# Altium schematic sheet FPGA.SchDoc: Pin Swapping
size 863 x 558 mm; DocumentNumber: 4; SheetNumber: 4; SheetTotal: 5
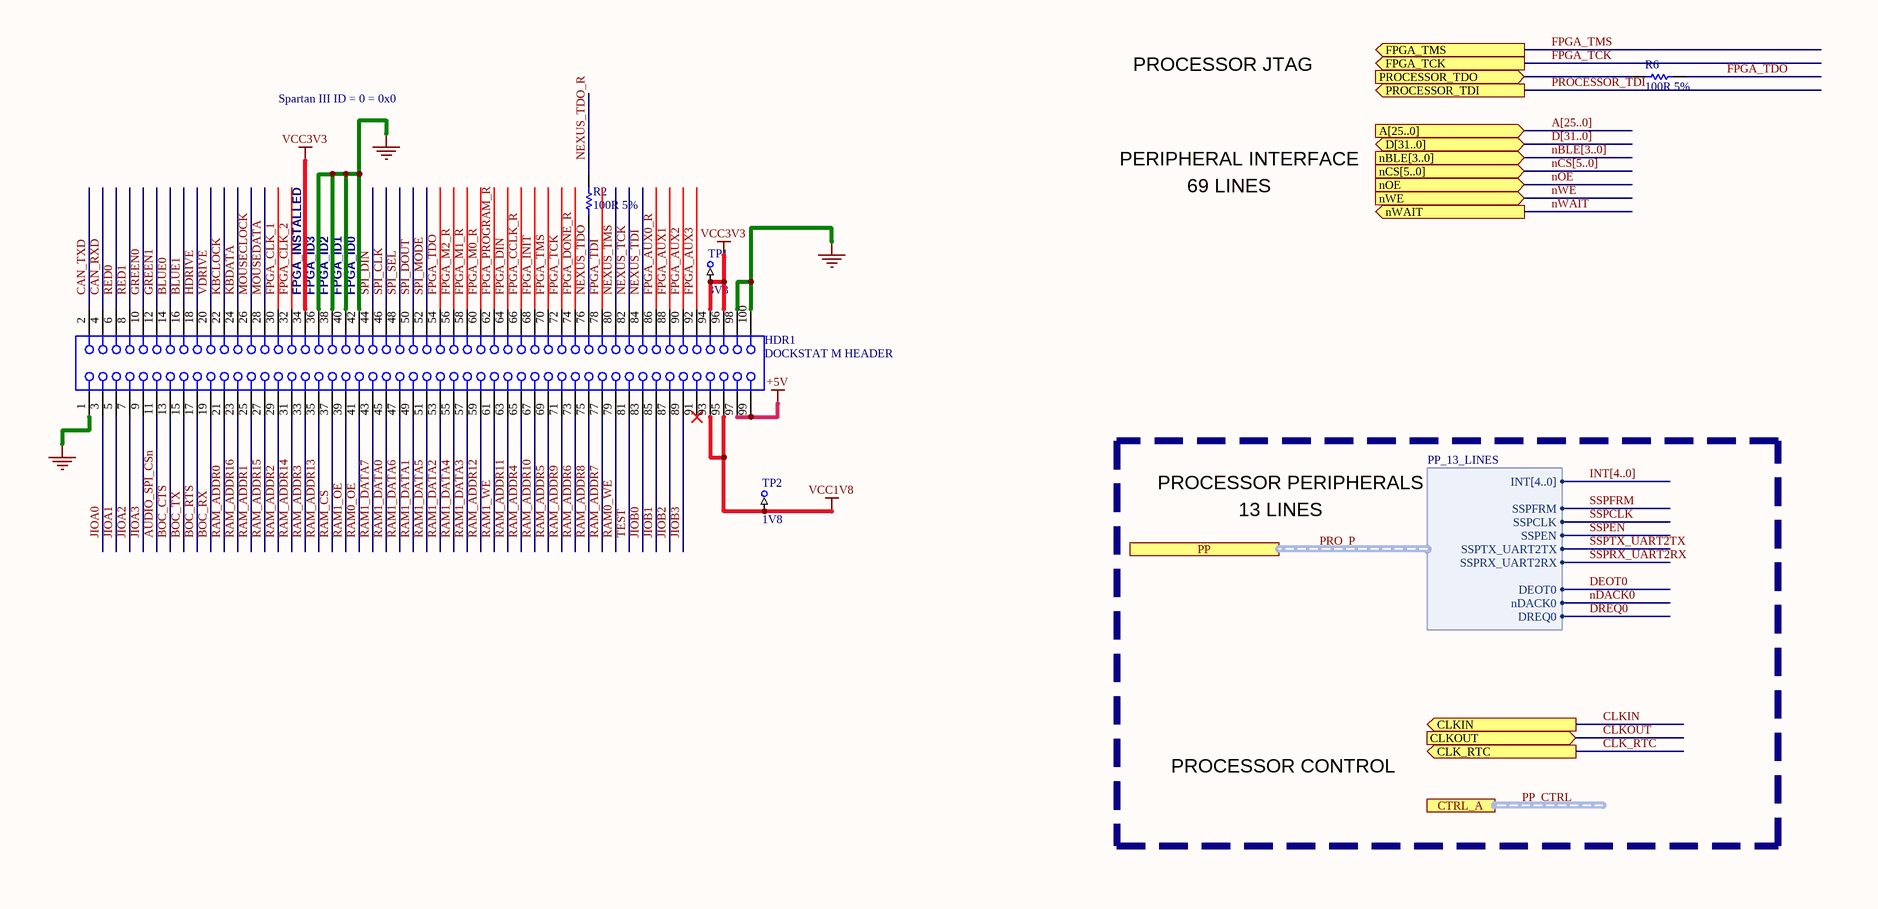
[diagram p0: FPGA.SchDoc, top left]
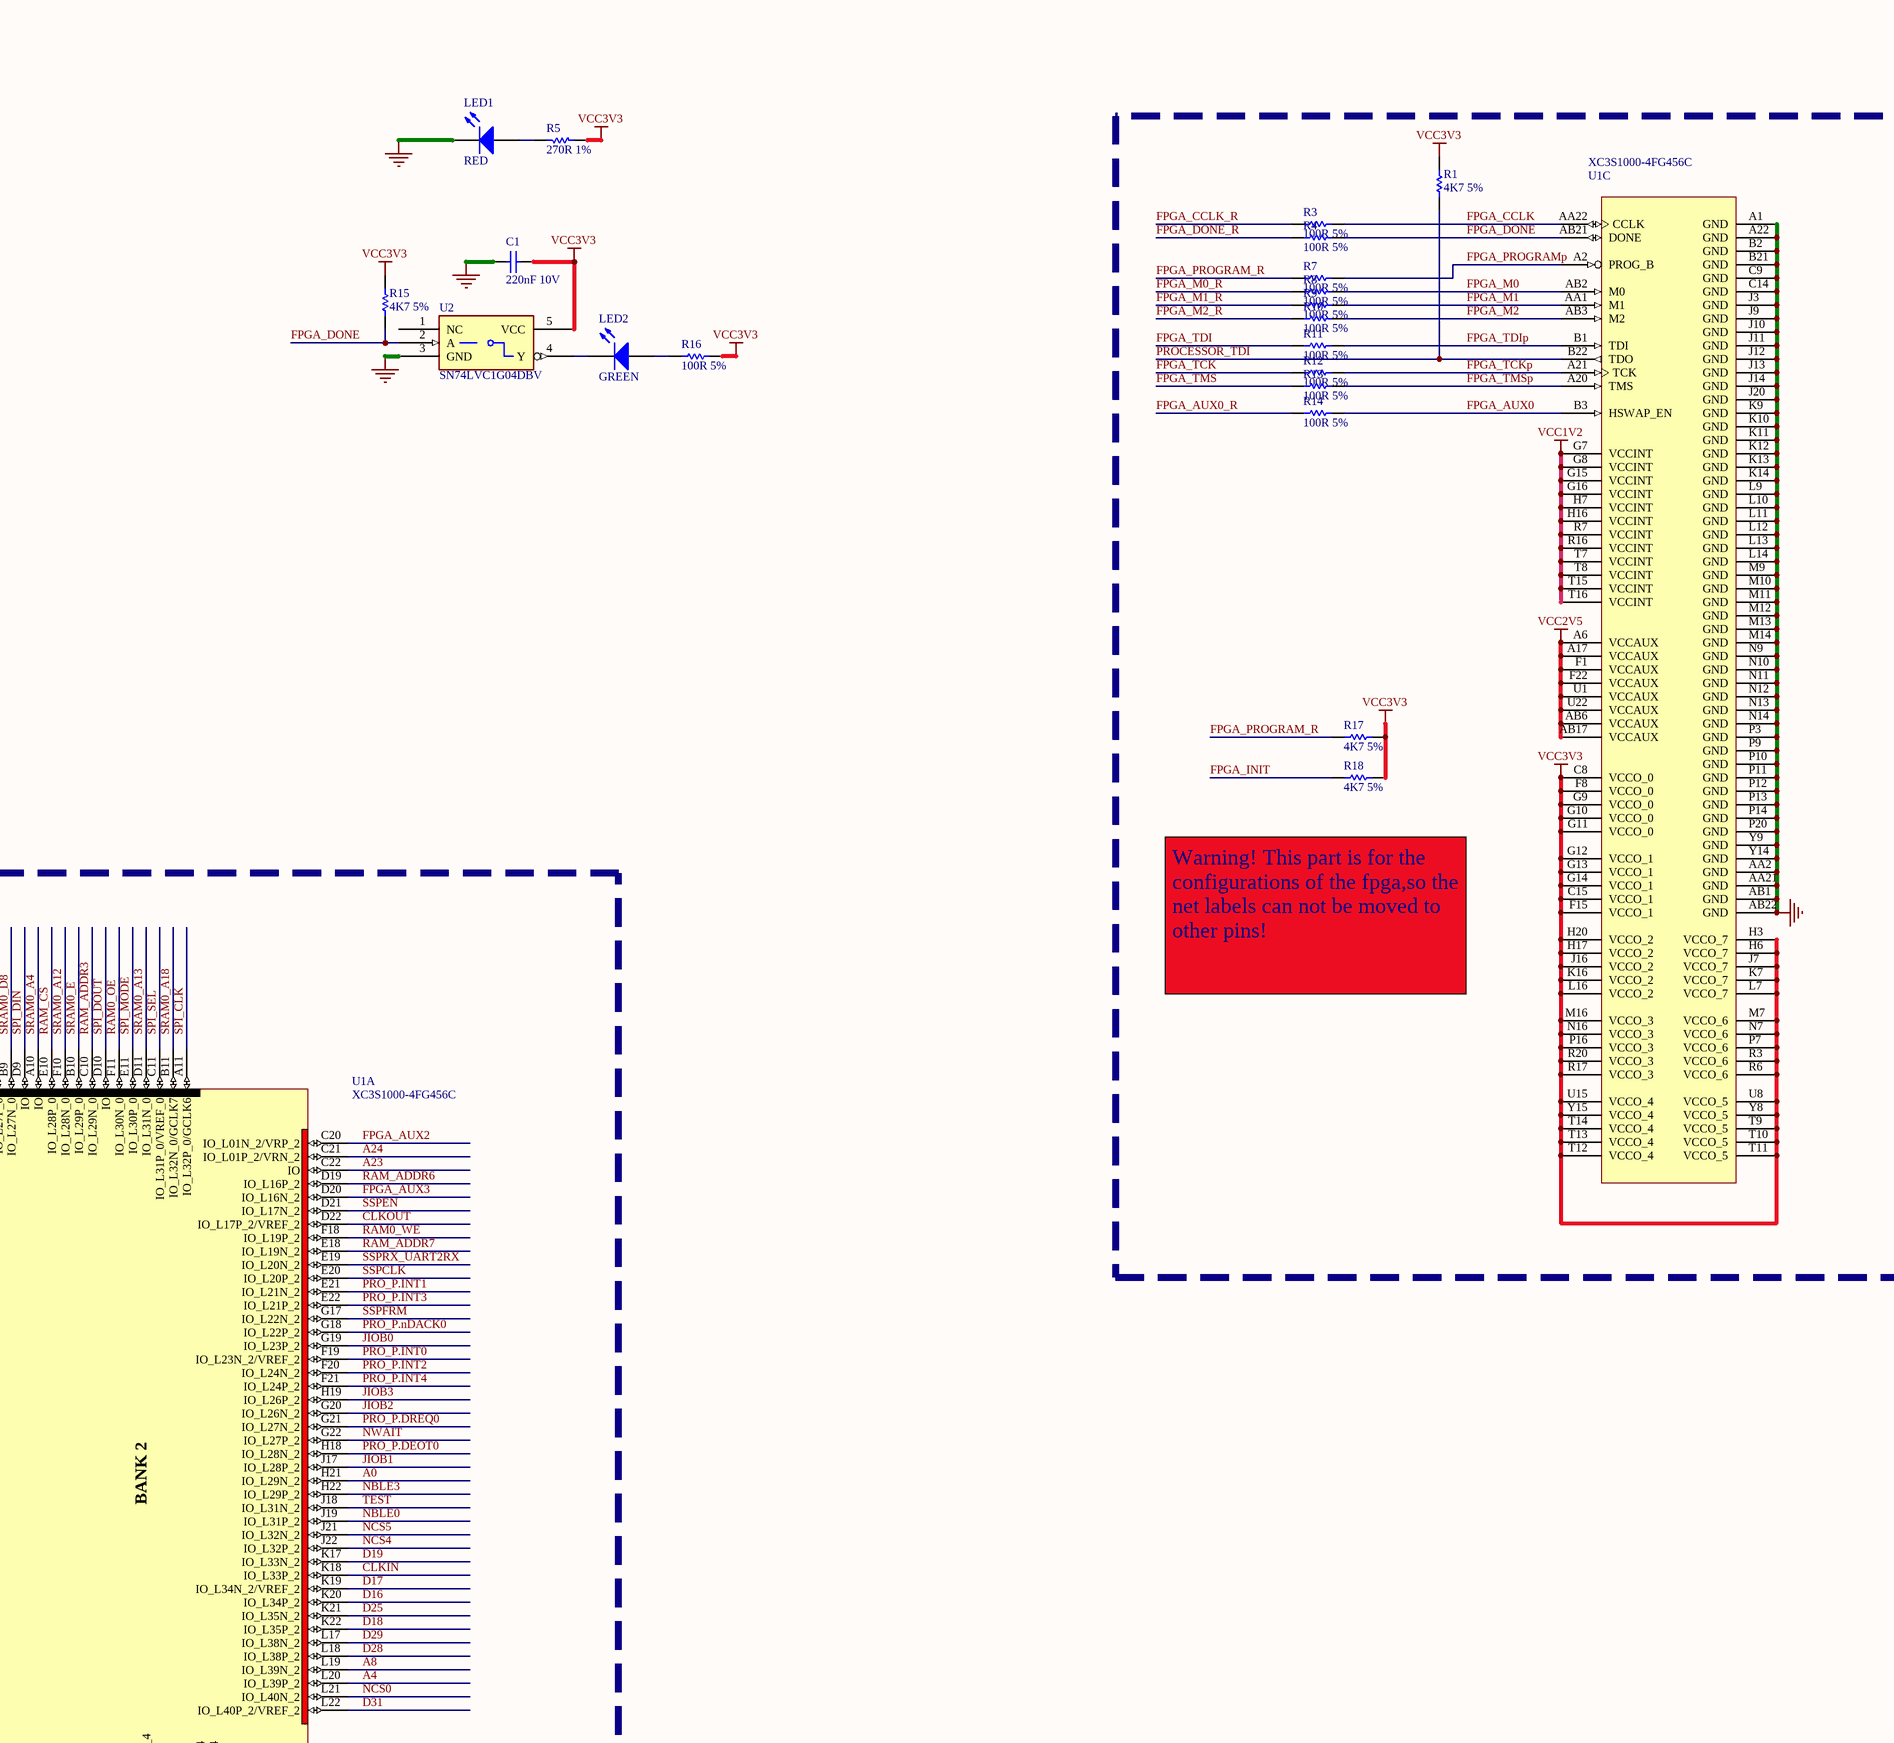
[diagram p1: FPGA.SchDoc, top right]
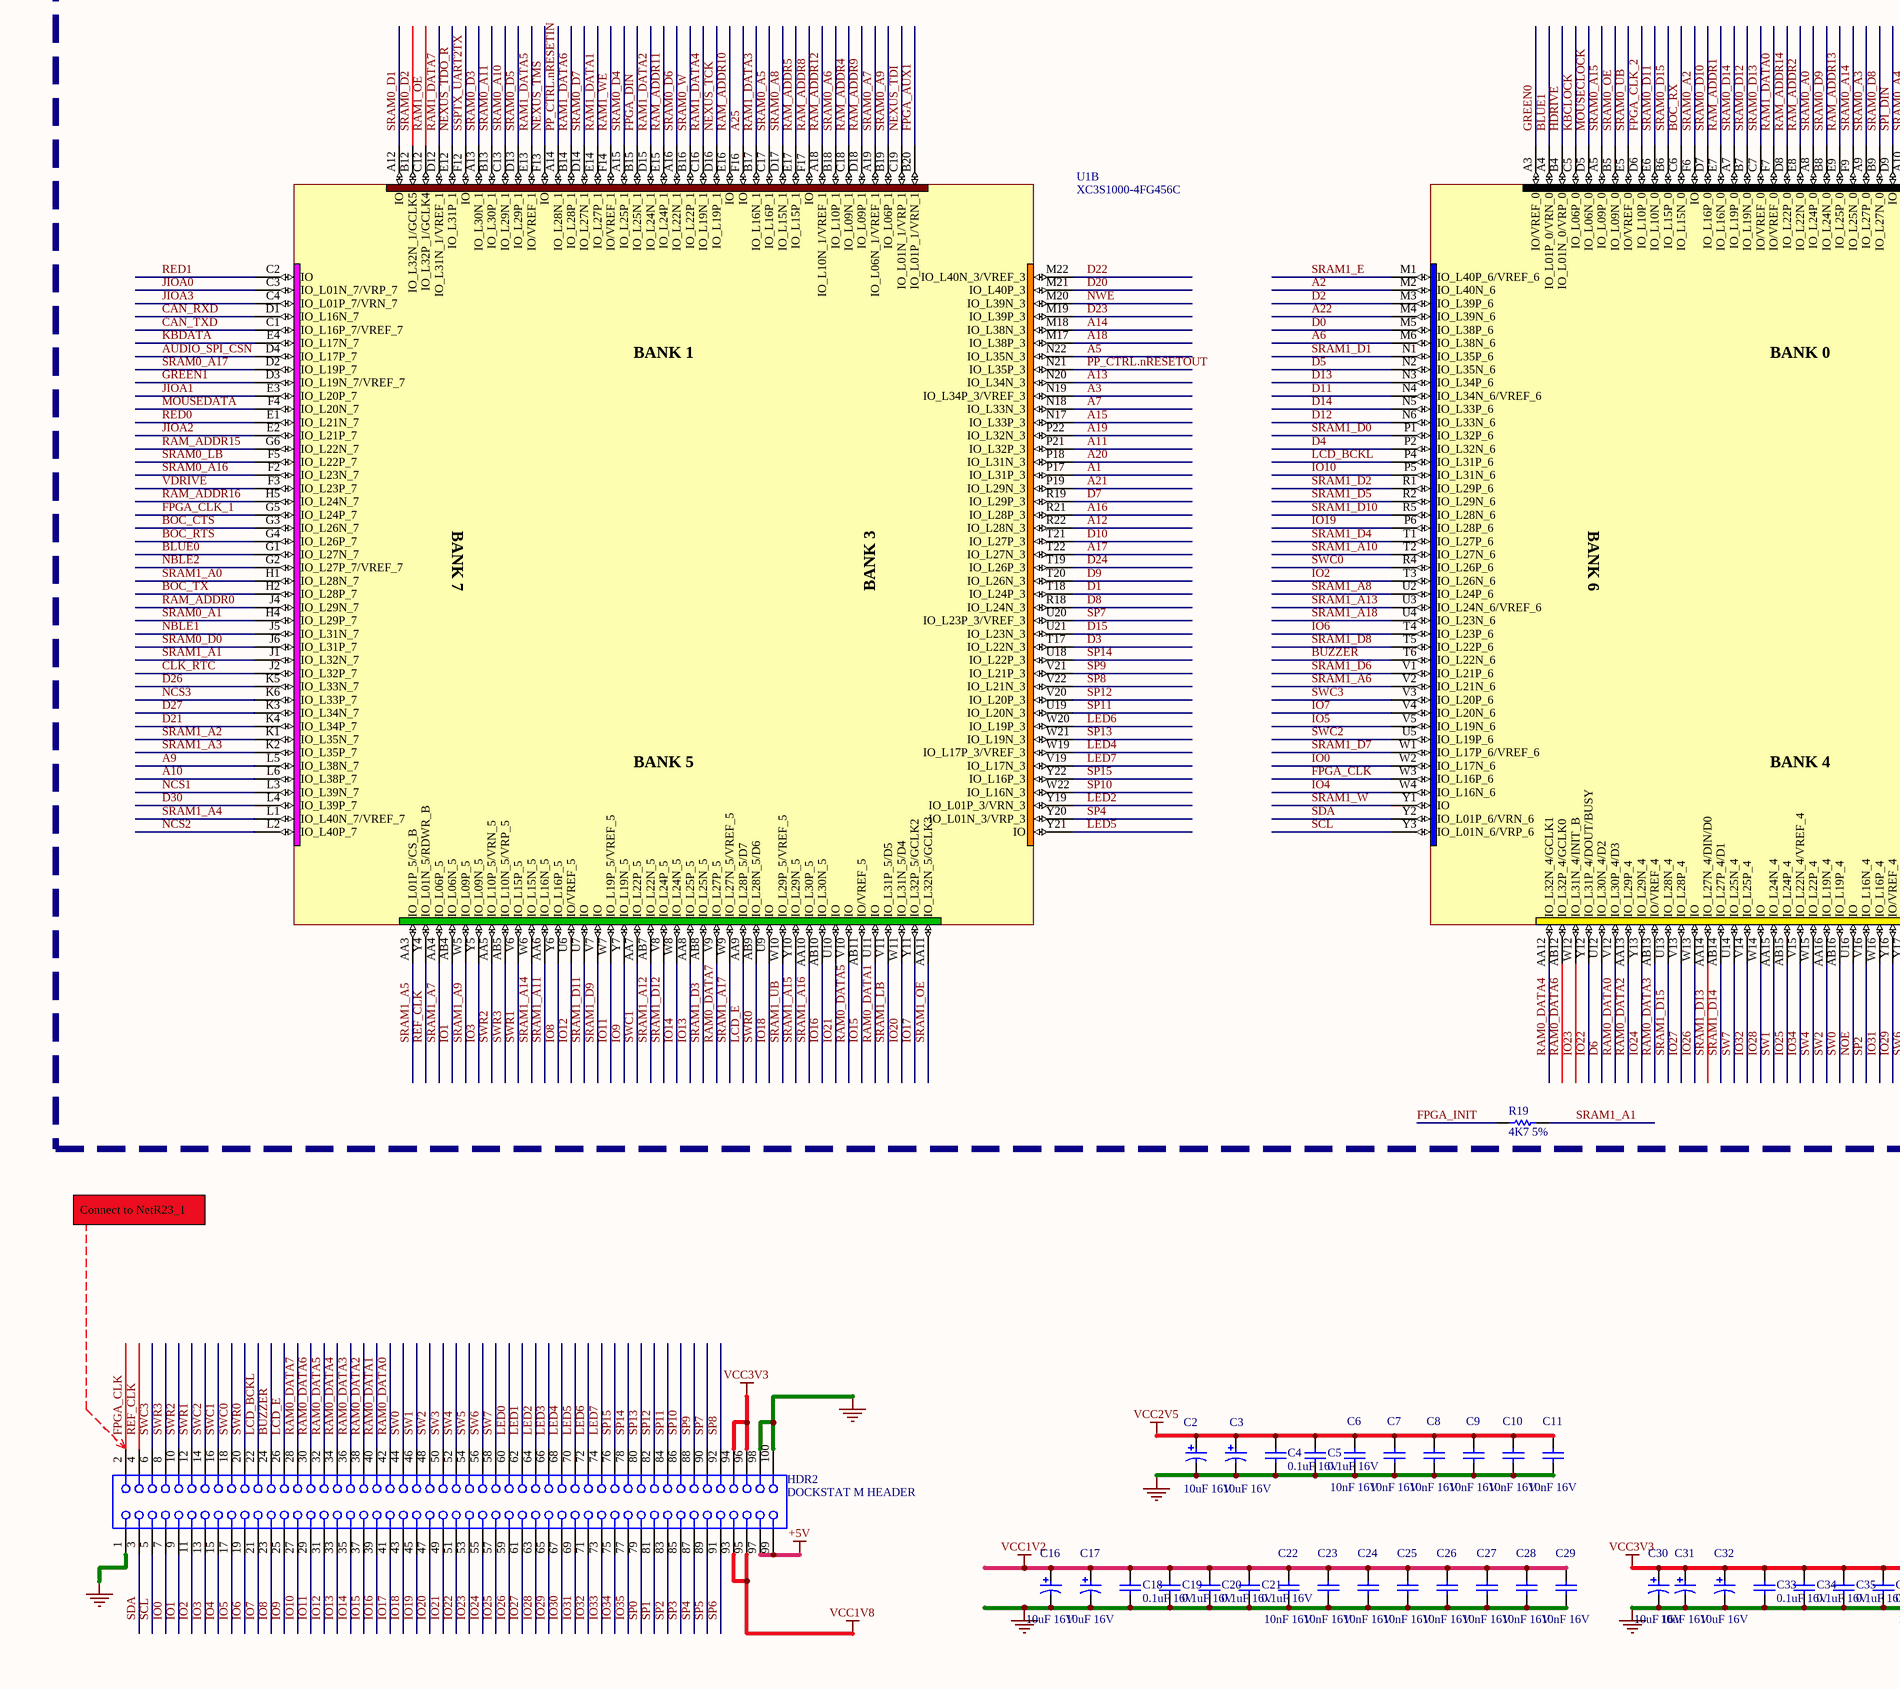
[diagram p2: FPGA.SchDoc, bottom left]
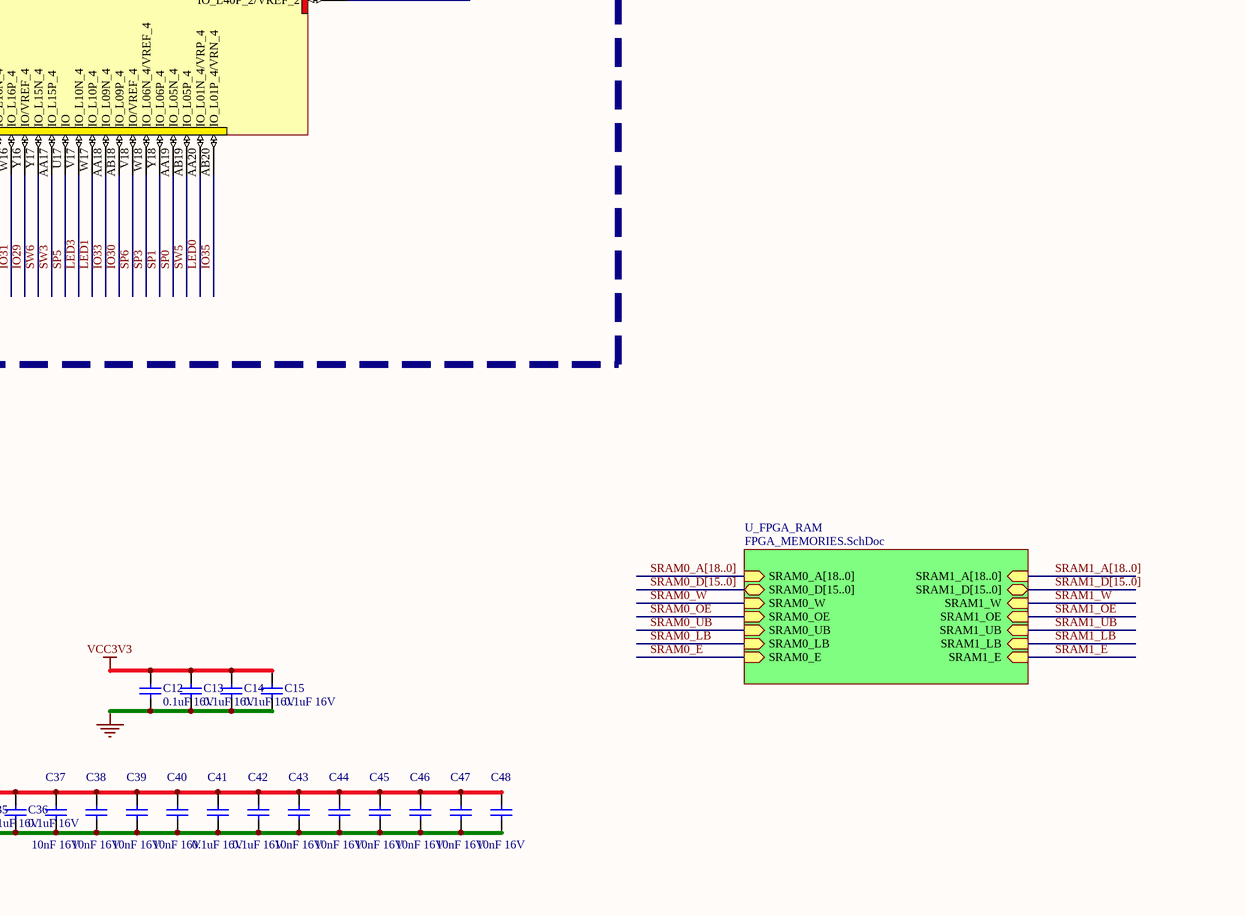
[diagram p3: FPGA.SchDoc, bottom right]

## Parts
C1  220nF 10V  [CAPC1608]
C2  10uF 16V  [CAPC3528]
C3  10uF 16V  [CAPC3528]
C4  0.1uF 16V  [CAPC1005]
C5  0.1uF 16V  [CAPC1005]
C6  10nF 16V  [CAPC1005]
C7  10nF 16V  [CAPC1005]
C8  10nF 16V  [CAPC1005]
C9  10nF 16V  [CAPC1005]
C10  10nF 16V  [CAPC1005]
C11  10nF 16V  [CAPC1005]
C12  0.1uF 16V  [CAPC1005]
C13  0.1uF 16V  [CAPC1005]
C14  0.1uF 16V  [CAPC1005]
C15  0.1uF 16V  [CAPC1005]
C16  10uF 16V  [CAPC3528]
C17  10uF 16V  [CAPC3528]
C18  0.1uF 16V  [CAPC1005]
C19  0.1uF 16V  [CAPC1005]
C20  0.1uF 16V  [CAPC1005]
C21  0.1uF 16V  [CAPC1005]
C22  10nF 16V  [CAPC1005]
C23  10nF 16V  [CAPC1005]
C24  10nF 16V  [CAPC1005]
C25  10nF 16V  [CAPC1005]
C26  10nF 16V  [CAPC1005]
C27  10nF 16V  [CAPC1005]
C28  10nF 16V  [CAPC1005]
C29  10nF 16V  [CAPC1005]
C30  10uF 16V  [CAPC3528]
C31  10uF 16V  [CAPC3528]
C32  10uF 16V  [CAPC3528]
C33  0.1uF 16V  [CAPC1005]
C34  0.1uF 16V  [CAPC1005]
C35  0.1uF 16V  [CAPC1005]
C36  0.1uF 16V  [CAPC1005]
C37  10nF 16V  [CAPC1005]
C38  10nF 16V  [CAPC1005]
C39  10nF 16V  [CAPC1005]
C40  10nF 16V  [CAPC1005]
C41  0.1uF 16V  [CAPC1005]
C42  0.1uF 16V  [CAPC1005]
C43  10nF 16V  [CAPC1005]
C44  10nF 16V  [CAPC1005]
C45  10nF 16V  [CAPC1005]
C46  10nF 16V  [CAPC1005]
C47  10nF 16V  [CAPC1005]
C48  10nF 16V  [CAPC1005]
HDR1  DOCKSTAT M HEADER  [54075]
HDR2  DOCKSTAT M HEADER  [54075]
LED1  RED  [LED2013]
LED2  GREEN  [LED2013]
R1  4K7 5%  [RESC1005]
R2  100R 5%  [RESC2012]
R3  100R 5%  [RESC2012]
R4  100R 5%  [RESC2012]
R5  270R 1%  [RESC2012]
R6  100R 5%  [RESC2012]
R7  100R 5%  [RESC2012]
R8  100R 5%  [RESC2012]
R9  100R 5%  [RESC2012]
R10  100R 5%  [RESC2012]
R11  100R 5%  [RESC2012]
R12  100R 5%  [RESC2012]
R13  100R 5%  [RESC2012]
R14  100R 5%  [RESC2012]
R15  4K7 5%  [RESC1005]
R16  100R 5%  [RESC2012]
R17  4K7 5%  [RESC1005]
R18  4K7 5%  [RESC1005]
R19  4K7 5%  [RESC1005]
TP1  3V3  [TestPin]  (no BOM)
TP2  1V8  [TestPin]  (no BOM)
U1  XC3S1000-4FG456C  [BGA100P22X22-456]  (parts A,B,C of 3)
U2  SN74LVC1G04DBV  [SOT95P280-5]

## Sub-sheets
U_FPGA_RAM = FPGA_MEMORIES.SchDoc: SRAM0_A[18..0] (in), SRAM0_D[15..0] (bidir), SRAM0_W (in), SRAM0_OE (in), SRAM0_UB (in), SRAM0_LB (in), SRAM0_E (in), SRAM1_A[18..0] (in), SRAM1_D[15..0] (bidir), SRAM1_W (in), SRAM1_OE (in), SRAM1_UB (in), SRAM1_LB (in), SRAM1_E (in)

## Ports
A[25..0] (in), CLK_RTC (out), CLKIN (out), CLKOUT (in), CTRL_A (harness P_C_HARNESS), D[31..0] (bidir), FPGA_TCK (out), FPGA_TMS (out), nBLE[3..0] (in), nCS[5..0] (in), nOE (in), nWAIT (out), nWE (in), PP (harness PP_13_LINES), PROCESSOR_TDI (out), PROCESSOR_TDO (in)

## Harnesses
PP_13_LINES: INT[4..0], SSPFRM, SSPCLK, SSPEN, SSPTX_UART2TX, SSPRX_UART2RX, DEOT0, nDACK0, DREQ0

## Nets
+5V: HDR1.97 HDR1.99 HDR2.97 HDR2.99
GND: C1.1 C2.2 C3.2 C4.2 C5.2 C6.2 C7.2 C8.2 C9.2 C10.2 C11.2 C12.2 C13.2 C14.2 C15.2 C16.2 C17.2 C18.2 C19.2 C20.2 C21.2 C22.2 C23.2 C24.2 C25.2 C26.2 C27.2 C28.2 C29.2 C30.2 C31.2 C32.2 C33.2 C34.2 C35.2 C36.2 C37.2 C38.2 C39.2 C40.2 C41.2 C42.2 C43.2 C44.2 C45.2 C46.2 C47.2 C48.2 HDR1.1 HDR1.36 HDR1.38 HDR1.40 HDR1.42 HDR1.98 HDR1.100 HDR2.1 HDR2.98 HDR2.100 LED1.2(K) U1.A1(GND) U1.A22(GND) U1.AA2(GND) U1.AA21(GND) U1.AB1(GND) U1.AB22(GND) U1.B2(GND) U1.B21(GND) U1.C9(GND) U1.C14(GND) U1.J3(GND) U1.J9(GND) U1.J10(GND) U1.J11(GND) U1.J12(GND) U1.J13(GND) U1.J14(GND) U1.J20(GND) U1.K9(GND) U1.K10(GND) U1.K11(GND) U1.K12(GND) U1.K13(GND) U1.K14(GND) U1.L9(GND) U1.L10(GND) U1.L11(GND) U1.L12(GND) U1.L13(GND) U1.L14(GND) U1.M9(GND) U1.M10(GND) U1.M11(GND) U1.M12(GND) U1.M13(GND) U1.M14(GND) U1.N9(GND) U1.N10(GND) U1.N11(GND) U1.N12(GND) U1.N13(GND) U1.N14(GND) U1.P3(GND) U1.P9(GND) U1.P10(GND) U1.P11(GND) U1.P12(GND) U1.P13(GND) U1.P14(GND) U1.P20(GND) U1.Y9(GND) U1.Y14(GND) U2.3(GND)
VCC1V2: C16.1 C17.1 C18.1 C19.1 C20.1 C21.1 C22.1 C23.1 C24.1 C25.1 C26.1 C27.1 C28.1 C29.1 U1.G7(VCCINT) U1.G8(VCCINT) U1.G15(VCCINT) U1.G16(VCCINT) U1.H7(VCCINT) U1.H16(VCCINT) U1.R7(VCCINT) U1.R16(VCCINT) U1.T7(VCCINT) U1.T8(VCCINT) U1.T15(VCCINT) U1.T16(VCCINT)
VCC1V8: HDR1.93 HDR1.95 HDR2.93 HDR2.95 TP2.1
VCC2V5: C2.1 C3.1 C4.1 C5.1 C6.1 C7.1 C8.1 C9.1 C10.1 C11.1 U1.A6(VCCAUX) U1.A17(VCCAUX) U1.AB6(VCCAUX) U1.AB17(VCCAUX) U1.F1(VCCAUX) U1.F22(VCCAUX) U1.U1(VCCAUX) U1.U22(VCCAUX)
VCC3V3: C1.2 C12.1 C13.1 C14.1 C15.1 C30.1 C31.1 C32.1 C33.1 C34.1 C35.1 C36.1 C37.1 C38.1 C39.1 C40.1 C41.1 C42.1 C43.1 C44.1 C45.1 C46.1 C47.1 C48.1 HDR1.34 HDR1.94 HDR1.96 HDR2.94 HDR2.96 R1.1 R5.1 R15.2 R16.2 R17.2 R18.2 TP1.1 U1.C8(VCCO_0) U1.C15(VCCO_1) U1.F8(VCCO_0) U1.F15(VCCO_1) U1.G9(VCCO_0) U1.G10(VCCO_0) U1.G11(VCCO_0) U1.G12(VCCO_1) U1.G13(VCCO_1) U1.G14(VCCO_1) U1.H3(VCCO_7) U1.H6(VCCO_7) U1.H17(VCCO_2) U1.H20(VCCO_2) U1.J7(VCCO_7) U1.J16(VCCO_2) U1.K7(VCCO_7) U1.K16(VCCO_2) U1.L7(VCCO_7) U1.L16(VCCO_2) U1.M7(VCCO_6) U1.M16(VCCO_3) U1.N7(VCCO_6) U1.N16(VCCO_3) U1.P7(VCCO_6) U1.P16(VCCO_3) U1.R3(VCCO_6) U1.R6(VCCO_6) U1.R17(VCCO_3) U1.R20(VCCO_3) U1.T9(VCCO_5) U1.T10(VCCO_5) U1.T11(VCCO_5) U1.T12(VCCO_4) U1.T13(VCCO_4) U1.T14(VCCO_4) U1.U8(VCCO_5) U1.U15(VCCO_4) U1.Y8(VCCO_5) U1.Y15(VCCO_4) U2.5(VCC)
A0: U1.H21(IO_L29N_2)
A1: U1.P17(IO_L31P_3)
A2: U1.M2(IO_L40N_6)
A3: U1.N19(IO_L34P_3/VREF_3)
A4: U1.L20(IO_L39P_2)
A5: U1.N22(IO_L35N_3)
A6: U1.M6(IO_L38N_6)
A7: U1.N18(IO_L33N_3)
A8: U1.L19(IO_L39N_2)
A9: U1.L5(IO_L38N_7)
A10: U1.L6(IO_L38P_7)
A11: U1.P21(IO_L32P_3)
A12: U1.R22(IO_L28N_3)
A13: U1.N20(IO_L34N_3)
A14: U1.M18(IO_L38N_3)
A15: U1.N17(IO_L33P_3)
A16: U1.R21(IO_L28P_3)
A17: U1.T22(IO_L27N_3)
A18: U1.M17(IO_L38P_3)
A19: U1.P22(IO_L32N_3)
A20: U1.P18(IO_L31N_3)
A21: U1.P19(IO_L29N_3)
A22: U1.M4(IO_L39N_6)
A23: U1.C22(IO)
A24: U1.C21(IO_L01P_2/VRN_2)
A25: U1.F16(IO)
AUDIO_SPI_CSn: HDR1.11 U1.D4(IO_L17P_7)
BLUE0: HDR1.14 U1.G1(IO_L27N_7)
BLUE1: HDR1.16 U1.A4(IO_L01P_0/VRN_0)
BOC_CTS: HDR1.13 U1.G3(IO_L26N_7)
BOC_RTS: HDR1.17 U1.G4(IO_L26P_7)
BOC_RX: HDR1.19 U1.C6(IO_L15N_0)
BOC_TX: HDR1.15 U1.H2(IO_L28P_7)
BUZZER: HDR2.24 U1.T6(IO_L22N_6)
CAN_RXD: HDR1.4 U1.D1(IO_L16N_7)
CAN_TXD: HDR1.2 U1.C1(IO_L16P_7/VREF_7)
CLK_RTC: U1.J2(IO_L32P_7) ; port CLK_RTC
CLKIN: U1.K18(IO_L33P_2) ; port CLKIN
CLKOUT: U1.D22(IO_L17P_2/VREF_2) ; port CLKOUT
D0: U1.M5(IO_L38P_6)
D1: U1.T18(IO_L24P_3)
D2: U1.M3(IO_L39P_6)
D3: U1.T17(IO_L22N_3)
D4: U1.P2(IO_L32N_6)
D5: U1.N2(IO_L35N_6)
D6: U1.U12(IO_L30N_4/D2)
D7: U1.R19(IO_L29P_3)
D8: U1.R18(IO_L24N_3)
D9: U1.T20(IO_L26N_3)
D10: U1.T21(IO_L27P_3)
D11: U1.N4(IO_L34N_6/VREF_6)
D12: U1.N6(IO_L33N_6)
D13: U1.N3(IO_L34P_6)
D14: U1.N5(IO_L33P_6)
D15: U1.U21(IO_L23N_3)
D16: U1.K20(IO_L34P_2)
D17: U1.K19(IO_L34N_2/VREF_2)
D18: U1.K22(IO_L35P_2)
D19: U1.K17(IO_L33N_2)
D20: U1.M21(IO_L40P_3)
D21: U1.K4(IO_L34P_7)
D22: U1.M22(IO_L40N_3/VREF_3)
D23: U1.M19(IO_L39P_3)
D24: U1.T19(IO_L26P_3)
D25: U1.K21(IO_L35N_2)
D26: U1.K5(IO_L33N_7)
D27: U1.K3(IO_L34N_7)
D28: U1.L18(IO_L38P_2)
D29: U1.L17(IO_L38N_2)
D30: U1.L4(IO_L39P_7)
D31: U1.L22(IO_L40P_2/VREF_2)
DEOT0: port PP.DEOT0
DREQ0: port PP.DREQ0
FPGA_AUX0: R14.1 U1.B3(HSWAP_EN)
FPGA_AUX0_R: HDR1.86 R14.2
FPGA_AUX1: HDR1.88 U1.B20(IO_L01P_1/VRN_1)
FPGA_AUX2: HDR1.90 U1.C20(IO_L01N_2/VRP_2)
FPGA_AUX3: HDR1.92 U1.D20(IO_L16N_2)
FPGA_CCLK: R3.2 U1.AA22(CCLK)
FPGA_CCLK_R: HDR1.66 R3.1
FPGA_CLK: HDR2.2 U1.W3(IO_L16P_6)
FPGA_CLK_1: HDR1.30 U1.G5(IO_L24P_7)
FPGA_CLK_2: HDR1.32 U1.D6(IO_L10P_0)
FPGA_DIN: HDR1.64 U1.B15(IO_L25N_1)
FPGA_DONE: R4.2 R15.1 U1.AB21(DONE) U2.2(A)
FPGA_DONE_R: HDR1.74 R4.1
FPGA_INIT: HDR1.68 R18.1 R19.1
FPGA_M0: R8.2 U1.AB2(M0)
FPGA_M0_R: HDR1.60 R8.1
FPGA_M1: R9.2 U1.AA1(M1)
FPGA_M1_R: HDR1.58 R9.1
FPGA_M2: R10.2 U1.AB3(M2)
FPGA_M2_R: HDR1.56 R10.1
FPGA_PROGRAM_R: HDR1.62 R7.1 R17.1
FPGA_PROGRAMp: R7.2 U1.A2(PROG_B)
FPGA_TCK: HDR1.72 R12.1 ; port FPGA_TCK
FPGA_TCKp: R12.2 U1.A21(TCK)
FPGA_TDI: HDR1.78 R11.1
FPGA_TDIp: R11.2 U1.B1(TDI)
FPGA_TDO: HDR1.54 R6.2
FPGA_TMS: HDR1.70 R13.1 ; port FPGA_TMS
FPGA_TMSp: R13.2 U1.A20(TMS)
GREEN0: HDR1.10 U1.A3(IO/VREF_0)
GREEN1: HDR1.12 U1.D3(IO_L19N_7/VREF_7)
HDRIVE: HDR1.18 U1.B4(IO_L01N_0/VRP_0)
IO0: HDR2.7 U1.W2(IO_L17N_6)
IO1: HDR2.9 U1.AB4(IO_L06N_5)
IO2: HDR2.11 U1.T3(IO_L26N_6)
IO3: HDR2.13 U1.Y5(IO_L09N_5)
IO4: HDR2.15 U1.W4(IO_L16N_6)
IO5: HDR2.17 U1.V5(IO_L19N_6)
IO6: HDR2.19 U1.T4(IO_L23P_6)
IO7: HDR2.21 U1.V4(IO_L20N_6)
IO8: HDR2.23 U1.Y6(IO_L16P_5)
IO9: HDR2.25 U1.Y7(IO_L19N_5)
IO10: HDR2.27 U1.P5(IO_L31N_6)
IO11: HDR2.29 U1.W7(IO_L19P_5/VREF_5)
IO12: HDR2.31 U1.U6(IO/VREF_5)
IO13: HDR2.33 U1.AA8(IO_L25P_5)
IO14: HDR2.35 U1.W8(IO_L24N_5)
IO15: HDR2.37 U1.AB11(IO/VREF_5)
IO16: HDR2.39 U1.AB10(IO_L30N_5)
IO17: HDR2.41 U1.Y11(IO_L32P_5/GCLK2)
IO18: HDR2.43 U1.U9(IO)
IO19: HDR2.45 U1.P6(IO_L28P_6)
IO20: HDR2.47 U1.W11(IO_L31N_5/D4)
IO21: HDR2.49 U1.U10(IO)
IO22: HDR2.51 U1.Y12(IO_L31P_4/DOUT/BUSY)
IO23: HDR2.53 U1.W12(IO_L31N_4/INIT_B)
IO24: HDR2.55 U1.Y13(IO_L29N_4)
IO25: HDR2.57 U1.AB15(IO_L24P_4)
IO26: HDR2.59 U1.W13(IO)
IO27: HDR2.61 U1.V13(IO_L28P_4)
IO28: HDR2.63 U1.W14(IO)
IO29: HDR2.65 U1.Y16(IO/VREF_4)
IO30: HDR2.67 U1.AB18(IO_L09P_4)
IO31: HDR2.69 U1.W16(IO_L16P_4)
IO32: HDR2.71 U1.V14(IO_L25P_4)
IO33: HDR2.73 U1.AA18(IO_L09N_4)
IO34: HDR2.75 U1.V15(IO_L22N_4/VREF_4)
IO35: HDR2.77 U1.AB20(IO_L01P_4/VRN_4)
JIOA0: HDR1.3 U1.C3(IO_L01N_7/VRP_7)
JIOA1: HDR1.5 U1.E3(IO_L20P_7)
JIOA2: HDR1.7 U1.E2(IO_L21P_7)
JIOA3: HDR1.9 U1.C4(IO_L01P_7/VRN_7)
JIOB0: HDR1.83 U1.G19(IO_L23P_2)
JIOB1: HDR1.85 U1.J17(IO_L28P_2)
JIOB2: HDR1.87 U1.G20(IO_L26N_2)
JIOB3: HDR1.89 U1.H19(IO_L26P_2)
KBCLOCK: HDR1.22 U1.C5(IO_L06P_0)
KBDATA: HDR1.24 U1.E4(IO_L17N_7)
LCD_BCKL: HDR2.22 U1.P4(IO_L31P_6)
LCD_E: HDR2.26 U1.AA9(IO_L28P_5/D7)
LED0: HDR2.60 U1.AA20(IO_L01N_4/VRP_4)
LED1: HDR2.62 U1.W17(IO_L10P_4)
LED2: HDR2.64 U1.Y19(IO_L01P_3/VRN_3)
LED3: HDR2.66 U1.V17(IO_L10N_4)
LED4: HDR2.68 U1.W19(IO_L17P_3/VREF_3)
LED5: HDR2.70 U1.Y21(IO)
LED6: HDR2.72 U1.W20(IO_L19P_3)
LED7: HDR2.74 U1.V19(IO_L17N_3)
MOUSECLOCK: HDR1.26 U1.D5(IO_L06N_0)
MOUSEDATA: HDR1.28 U1.F4(IO_L20N_7)
NBLE0: U1.J19(IO_L31P_2)
NBLE1: U1.J5(IO_L31N_7)
NBLE2: U1.G2(IO_L27P_7/VREF_7)
NBLE3: U1.H22(IO_L29P_2)
NCS0: U1.L21(IO_L40N_2)
NCS1: U1.L3(IO_L39N_7)
NCS2: U1.L2(IO_L40P_7)
NCS3: U1.K6(IO_L33P_7)
NCS4: U1.J22(IO_L32P_2)
NCS5: U1.J21(IO_L32N_2)
nDACK0: port PP.nDACK0
NEXUS_TCK: HDR1.82 U1.D16(IO_L19P_1)
NEXUS_TDI: HDR1.84 U1.C19(IO_L01N_1/VRP_1)
NEXUS_TDO: HDR1.76 R2.1
NEXUS_TDO_R: R2.2 U1.E12(IO_L31P_1)
NEXUS_TMS: HDR1.80 U1.F13(IO)
nOE: U1.U16(IO) ; port nOE
nWAIT: U1.G22(IO_L27P_2) ; port nWAIT
nWE: U1.M20(IO_L39N_3) ; port nWE
PP_CTRL.nRESETIN: U1.A14(IO_L28N_1)
PP_CTRL.nRESETOUT: U1.N21(IO_L35P_3)
PRO_P.DEOT0: U1.H18(IO_L28N_2)
PRO_P.DREQ0: U1.G21(IO_L27N_2)
PRO_P.INT0: U1.F19(IO_L23N_2/VREF_2)
PRO_P.INT1: U1.E21(IO_L21N_2)
PRO_P.INT2: U1.F20(IO_L24N_2)
PRO_P.INT3: U1.E22(IO_L21P_2)
PRO_P.INT4: U1.F21(IO_L24P_2)
PRO_P.nDACK0: U1.G18(IO_L22P_2)
PROCESSOR_TDI: R1.2 U1.B22(TDO) ; port PROCESSOR_TDI
PROCESSOR_TDO: R6.1 ; port PROCESSOR_TDO
RAM0_DATA0: HDR2.42 U1.V12(IO_L30P_4/D3)
RAM0_DATA1: HDR2.40 U1.U11(IO)
RAM0_DATA2: HDR2.38 U1.AA13(IO_L29P_4)
RAM0_DATA3: HDR2.36 U1.AB13(IO/VREF_4)
RAM0_DATA4: HDR2.34 U1.AA12(IO_L32N_4/GCLK1)
RAM0_DATA5: HDR2.32 U1.V10(IO)
RAM0_DATA6: HDR2.30 U1.AB12(IO_L32P_4/GCLK0)
RAM0_DATA7: HDR2.28 U1.V9(IO_L27P_5)
RAM0_OE: HDR1.41 U1.F11(IO_L30N_0)
RAM0_WE: HDR1.79 U1.F18(IO_L19P_2)
RAM1_DATA0: HDR1.45 U1.F7(IO/VREF_0)
RAM1_DATA1: HDR1.49 U1.E14(IO_L27P_1)
RAM1_DATA2: HDR1.53 U1.D15(IO_L24N_1)
RAM1_DATA3: HDR1.57 U1.B17(IO_L16N_1)
RAM1_DATA4: HDR1.55 U1.C16(IO_L19N_1)
RAM1_DATA5: HDR1.51 U1.E13(IO/VREF_1)
RAM1_DATA6: HDR1.47 U1.B14(IO_L28P_1)
RAM1_DATA7: HDR1.43 U1.D12(IO_L31N_1/VREF_1)
RAM1_OE: HDR1.39 U1.C12(IO_L32P_1/GCLK4)
RAM1_WE: HDR1.61 U1.F14(IO/VREF_1)
RAM_ADDR0: HDR1.21 U1.J4(IO_L29N_7)
RAM_ADDR1: HDR1.25 U1.E7(IO_L16N_0)
RAM_ADDR2: HDR1.29 U1.E8(IO_L22N_0)
RAM_ADDR3: HDR1.33 U1.C10(IO_L29N_0)
RAM_ADDR4: HDR1.65 U1.C18(IO_L09N_1)
RAM_ADDR5: HDR1.69 U1.E17(IO_L15P_1)
RAM_ADDR6: HDR1.73 U1.D19(IO_L16P_2)
RAM_ADDR7: HDR1.77 U1.E18(IO_L19N_2)
RAM_ADDR8: HDR1.75 U1.F17(IO)
RAM_ADDR9: HDR1.71 U1.D18(IO_L09P_1)
RAM_ADDR10: HDR1.67 U1.E16(IO)
RAM_ADDR11: HDR1.63 U1.E15(IO_L24P_1)
RAM_ADDR12: HDR1.59 U1.A18(IO_L10N_1/VREF_1)
RAM_ADDR13: HDR1.35 U1.E9(IO_L25P_0)
RAM_ADDR14: HDR1.31 U1.D8(IO_L22P_0)
RAM_ADDR15: HDR1.27 U1.G6(IO_L22N_7)
RAM_ADDR16: HDR1.23 U1.H5(IO_L24N_7)
RAM_CS: HDR1.37 U1.E10(IO_L28P_0)
RED0: HDR1.6 U1.E1(IO_L21N_7)
RED1: HDR1.8 U1.C2(IO)
REF_CLK: HDR2.4 U1.Y4(IO_L01N_5/RDWR_B)
SCL: HDR2.5 U1.Y3(IO_L01N_6/VRP_6)
SDA: HDR2.3 U1.Y2(IO_L01P_6/VRN_6)
SP0: HDR2.79 U1.AA19(IO_L05N_4)
SP1: HDR2.81 U1.Y18(IO_L06P_4)
SP2: HDR2.83 U1.V16(IO_L16N_4)
SP3: HDR2.85 U1.W18(IO_L06N_4/VREF_4)
SP4: HDR2.87 U1.Y20(IO_L01N_3/VRP_3)
SP5: HDR2.89 U1.U17(IO)
SP6: HDR2.91 U1.V18(IO/VREF_4)
SP7: HDR2.90 U1.U20(IO_L23P_3/VREF_3)
SP8: HDR2.92 U1.V22(IO_L21N_3)
SP9: HDR2.88 U1.V21(IO_L21P_3)
SP10: HDR2.86 U1.W22(IO_L16N_3)
SP11: HDR2.84 U1.U19(IO_L20N_3)
SP12: HDR2.82 U1.V20(IO_L20P_3)
SP13: HDR2.80 U1.W21(IO_L19N_3)
SP14: HDR2.78 U1.U18(IO_L22P_3)
SP15: HDR2.76 U1.Y22(IO_L16P_3)
SPI_CLK: HDR1.46 U1.A11(IO_L32P_0/GCLK6)
SPI_DIN: HDR1.44 U1.D9(IO)
SPI_DOUT: HDR1.50 U1.D10(IO)
SPI_MODE: HDR1.52 U1.E11(IO_L30P_0)
SPI_SEL: HDR1.48 U1.C11(IO_L31P_0/VREF_0)
SRAM0_A0: U1.A8(IO_L24P_0)
SRAM0_A1: U1.H4(IO_L29P_7)
SRAM0_A2: U1.F6(IO)
SRAM0_A3: U1.A9(IO_L27P_0)
SRAM0_A4: U1.A10(IO)
SRAM0_A5: U1.C17(IO_L16P_1)
SRAM0_A6: U1.B18(IO_L10P_1)
SRAM0_A7: U1.A19(IO_L06N_1/VREF_1)
SRAM0_A8: U1.D17(IO_L15N_1)
SRAM0_A9: U1.B19(IO_L06P_1)
SRAM0_A10: U1.C13(IO_L29N_1)
SRAM0_A11: U1.B13(IO_L30P_1)
SRAM0_A12: U1.F10(IO_L28N_0)
SRAM0_A13: U1.D11(IO_L31N_0)
SRAM0_A14: U1.F9(IO_L25N_0)
SRAM0_A15: U1.A5(IO_L09P_0)
SRAM0_A16: U1.F2(IO_L23N_7)
SRAM0_A17: U1.D2(IO_L19P_7)
SRAM0_A18: U1.B11(IO_L32N_0/GCLK7)
SRAM0_D0: U1.J6(IO_L31P_7)
SRAM0_D1: U1.A12(IO)
SRAM0_D2: U1.B12(IO_L32N_1/GCLK5)
SRAM0_D3: U1.A13(IO_L30N_1)
SRAM0_D4: U1.A15(IO_L25P_1)
SRAM0_D5: U1.D13(IO_L29P_1)
SRAM0_D6: U1.A16(IO_L22N_1)
SRAM0_D7: U1.D14(IO_L27N_1)
SRAM0_D8: U1.B9(IO_L27N_0)
SRAM0_D9: U1.B8(IO_L24N_0)
SRAM0_D10: U1.D7(IO_L16P_0)
SRAM0_D11: U1.E6(IO_L10N_0)
SRAM0_D12: U1.B7(IO_L19N_0)
SRAM0_D13: U1.C7(IO/VREF_0)
SRAM0_D14: U1.A7(IO_L19P_0)
SRAM0_D15: U1.B6(IO_L15P_0)
SRAM0_E: U1.B10(IO_L29P_0) ; sheet U_FPGA_RAM/SRAM0_E
SRAM0_LB: U1.F5(IO_L22P_7) ; sheet U_FPGA_RAM/SRAM0_LB
SRAM0_OE: U1.B5(IO_L09N_0) ; sheet U_FPGA_RAM/SRAM0_OE
SRAM0_UB: U1.E5(IO/VREF_0) ; sheet U_FPGA_RAM/SRAM0_UB
SRAM0_W: U1.B16(IO_L22P_1) ; sheet U_FPGA_RAM/SRAM0_W
SRAM1_A0: U1.H1(IO_L28N_7)
SRAM1_A1: R19.2 U1.J1(IO_L32N_7)
SRAM1_A2: U1.K1(IO_L35N_7)
SRAM1_A3: U1.K2(IO_L35P_7)
SRAM1_A4: U1.L1(IO_L40N_7/VREF_7)
SRAM1_A5: U1.AA3(IO_L01P_5/CS_B)
SRAM1_A6: U1.V2(IO_L21N_6)
SRAM1_A7: U1.AA4(IO_L06P_5)
SRAM1_A8: U1.U2(IO_L24P_6)
SRAM1_A9: U1.W5(IO_L09P_5)
SRAM1_A10: U1.T2(IO_L27N_6)
SRAM1_A11: U1.AA6(IO_L16N_5)
SRAM1_A12: U1.AB7(IO_L22N_5)
SRAM1_A13: U1.U3(IO_L24N_6/VREF_6)
SRAM1_A14: U1.W6(IO_L15N_5)
SRAM1_A15: U1.Y10(IO_L29N_5)
SRAM1_A16: U1.AA10(IO_L30P_5)
SRAM1_A17: U1.W9(IO_L27N_5/VREF_5)
SRAM1_A18: U1.U4(IO_L23N_6)
SRAM1_D0: U1.P1(IO_L32P_6)
SRAM1_D1: U1.N1(IO_L35P_6)
SRAM1_D2: U1.R1(IO_L29P_6)
SRAM1_D3: U1.AB8(IO_L25N_5)
SRAM1_D4: U1.T1(IO_L27P_6)
SRAM1_D5: U1.R2(IO_L29N_6)
SRAM1_D6: U1.V1(IO_L21P_6)
SRAM1_D7: U1.W1(IO_L17P_6/VREF_6)
SRAM1_D8: U1.T5(IO_L22P_6)
SRAM1_D9: U1.V7(IO)
SRAM1_D10: U1.R5(IO_L28N_6)
SRAM1_D11: U1.U7(IO)
SRAM1_D12: U1.V8(IO_L24P_5)
SRAM1_D13: U1.AA14(IO_L27N_4/DIN/D0)
SRAM1_D14: U1.AB14(IO_L27P_4/D1)
SRAM1_D15: U1.U13(IO_L28N_4)
SRAM1_E: U1.M1(IO_L40P_6/VREF_6) ; sheet U_FPGA_RAM/SRAM1_E
SRAM1_LB: U1.V11(IO_L31P_5/D5) ; sheet U_FPGA_RAM/SRAM1_LB
SRAM1_OE: U1.AA11(IO_L32N_5/GCLK3) ; sheet U_FPGA_RAM/SRAM1_OE
SRAM1_UB: U1.W10(IO_L29P_5/VREF_5) ; sheet U_FPGA_RAM/SRAM1_UB
SRAM1_W: U1.Y1(IO) ; sheet U_FPGA_RAM/SRAM1_W
SSPCLK: U1.E20(IO_L20P_2) ; port PP.SSPCLK  [project net PRO_P.SSPCLK]
SSPEN: U1.D21(IO_L17N_2) ; port PP.SSPEN  [project net PRO_P.SSPEN]
SSPFRM: U1.G17(IO_L22N_2) ; port PP.SSPFRM  [project net PRO_P.SSPFRM]
SSPRX_UART2RX: U1.E19(IO_L20N_2) ; port PP.SSPRX_UART2RX  [project net PRO_P.SSPRX_UART2RX]
SSPTX_UART2TX: U1.F12(IO) ; port PP.SSPTX_UART2TX  [project net PRO_P.SSPTX_UART2TX]
SW0: HDR2.44 U1.AB16(IO_L19P_4)
SW1: HDR2.46 U1.AA15(IO_L24N_4)
SW2: HDR2.48 U1.AA16(IO_L19N_4)
SW3: HDR2.50 U1.AA17(IO_L15P_4)
SW4: HDR2.52 U1.W15(IO_L22P_4)
SW5: HDR2.54 U1.AB19(IO_L05P_4)
SW6: HDR2.56 U1.Y17(IO_L15N_4)
SW7: HDR2.58 U1.U14(IO_L25N_4)
SWC0: HDR2.18 U1.R4(IO_L26P_6)
SWC1: HDR2.16 U1.AA7(IO_L22P_5)
SWC2: HDR2.14 U1.U5(IO_L19P_6)
SWC3: HDR2.6 U1.V3(IO_L20P_6)
SWR0: HDR2.20 U1.AB9(IO_L28N_5/D6)
SWR1: HDR2.12 U1.V6(IO_L15P_5)
SWR2: HDR2.10 U1.AA5(IO_L10P_5/VRN_5)
SWR3: HDR2.8 U1.AB5(IO_L10N_5/VRP_5)
TEST: HDR1.81 U1.J18(IO_L31N_2)
VDRIVE: HDR1.20 U1.F3(IO_L23P_7)
NetLED1_1: LED1.1(A) R5.2
NetLED2_1: LED2.1(A) R16.1
NetLED2_2: LED2.2(K) U2.4(Y)

Not connected (* = marked no-connect by the designer): HDR1 91*; U2 1(NC)

## Buses and harness runs
bus A[25..0] = port A[25..0]
bus D[31..0] = port D[31..0]
bus INT[4..0]
bus nBLE[3..0] = port nBLE[3..0]
bus nCS[5..0] = port nCS[5..0]
bus SRAM0_A[18..0] = sheet U_FPGA_RAM/SRAM0_A[18..0]
bus SRAM0_D[15..0] = sheet U_FPGA_RAM/SRAM0_D[15..0]
bus SRAM1_A[18..0] = sheet U_FPGA_RAM/SRAM1_A[18..0]
bus SRAM1_D[15..0] = sheet U_FPGA_RAM/SRAM1_D[15..0]
harness PP_CTRL = port CTRL_A
harness PRO_P = port PP

## Notes on the sheet
- PROCESSOR JTAG
- Spartan III ID = 0 = 0x0
- PERIPHERAL INTERFACE
- 69 LINES
- (near HDR1) FPGA_INSTALLED
- (near HDR1) FPGA_ID3
- (near HDR1) FPGA_ID2
- (near HDR1) FPGA_ID1
- (near HDR1) FPGA_ID0
- PROCESSOR PERIPHERALS
- 13 LINES
- PROCESSOR CONTROL
- Warning! This part is for the configurations of the fpga,so the net labels can not be moved to other pins!
- Connect to NetR23_1
- 12
- 11
- 10
- 9
- 8
- 7
- 6
- 5
- 4
- 3
- DWG. NO.
- 2
- 1
- REV.
- SHT.
- REVISION
- DESCRIPTION
- DATE
- APPROVED
- J
- THIS DOCUMENT AND THE DATA DISCLOSED HEREIN OR HEREWITH IS THE PROPERTY OF ALTIUM LIMITED AND MAY BE FREELY DISTRIBUTED IN WHOLE. NO RIGHTS ARE RESERVED OR EXPRESS OR IMPLIED WARANTEE GIVEN.
- I
- H
- G
- F
- E
- D
- C
- B
- A
- TITLE
- SCALE:
- SIZE
- CAGE CODE
- FILE NAME
- DWG NO.
- SHEET
- OF
- REV
- (in symbol XC3S1000-4FG456C, part A) BANK 0; BANK 6; BANK 2; BANK 4
- (in symbol XC3S1000-4FG456C, part B) BANK 1; BANK 7; BANK 3; BANK 5

## Library data of the parts
C1 = CAP-NP-220nF-10V-0603: Capacitor; Design Item Id: CAP-NP-220nF-10V-0603
C2 C3 C16 C17 C30-C32 = CAP-P-10uF-16V-MCCT-B: Polar Capacitor; Design Item Id: CAP-P-10uF-16V-MCCT-B
C4 C5 C12-C15 C18-C21 C33-C36 C41 C42 = CAP-NP-0.1uF-16V-0402: Capacitor; Design Item Id: CAP-NP-0.1uF-16V-0402
C6-C11 C22-C29 C37-C40 C43-C48 = CAP-NP-10nF-16V-0402: Capacitor; Design Item Id: CAP-NP-10nF-16V-0402
HDR1 HDR2 = CON-DOCKSTAT-M-0.8mm: Board-to-Board, Docking Station, 0.80mm (.031") Pitch, Shielded Receptacle, Vertical, Ultra Low Profile, SMT; Design Item Id: CON-DOCKSTAT-M-0.8mm
LED1 = LED-RED-HSMHC170: Typical GREEN SMD LED Agilent make; Design Item Id: LED-RED-HSMHC170
LED2 = LED-GRN-HSMHC170: Typical GREEN SMD LED Agilent make; Design Item Id: LED-GRN-HSMHC170
R1 R15 R17-R19 = RES-4K7-0402: Resistor; Design Item Id: RES-4K7-0402
R2-R4 R6-R14 R16 = RES-100R-0805: Resistor; Design Item Id: RES-100R-0805
R5 = RES-270R-1%-0805: Resistor; Design Item Id: RES-270R-1%-0805
TP1 TP2 = TestPin: Design Item Id: TestPin
U1 = XC3S1000-4FG456C: Spartan-3 1.2V FPGA, 333 User I/Os, 456-ball FBGA, Standard Performance, Commercial Grade; Design Item Id: XC3S1000-4FG456C
U2 = SN74LVC1G04DBV: Design Item Id: SN74LVC1G04DBV